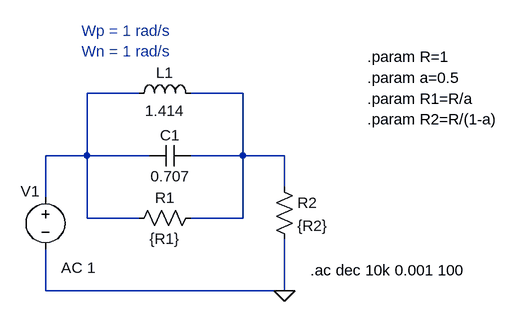
[diagram p0: schematic EJE2_B.asc]
EJE2_B.asc, the LTspice schematic file:
Version 4
SHEET 1 880 680
WIRE 80 64 0 64
WIRE 240 64 160 64
WIRE 0 160 0 64
WIRE 0 160 -64 160
WIRE 96 160 0 160
WIRE 240 160 240 64
WIRE 240 160 160 160
WIRE 304 160 240 160
WIRE 304 208 304 160
WIRE -64 224 -64 160
WIRE 0 256 0 160
WIRE 80 256 0 256
WIRE 240 256 240 160
WIRE 240 256 160 256
WIRE -64 368 -64 304
WIRE 304 368 304 288
WIRE 304 368 -64 368
FLAG 304 368 0
SYMBOL ind 64 80 R270
WINDOW 0 32 56 VTop 2
WINDOW 3 5 56 VBottom 2
SYMATTR InstName L1
SYMATTR Value 1.414
SYMBOL cap 160 144 R90
WINDOW 0 0 32 VBottom 2
WINDOW 3 32 32 VTop 2
SYMATTR InstName C1
SYMATTR Value 0.707
SYMBOL res 288 192 R0
SYMATTR InstName R2
SYMATTR Value {R2}
SYMBOL voltage -64 208 R0
WINDOW 123 24 124 Left 2
WINDOW 39 0 0 Left 0
WINDOW 0 -38 7 Left 2
SYMATTR Value2 AC 1
SYMATTR InstName V1
SYMATTR Value ""
SYMBOL res 176 240 R90
WINDOW 0 0 56 VBottom 2
WINDOW 3 32 56 VTop 2
SYMATTR InstName R1
SYMATTR Value {R1}
TEXT 432 40 Left 2 !.param a=0.5
TEXT 432 72 Left 2 !.param R1=R/a
TEXT 432 104 Left 2 !.param R2=R/(1-a)
TEXT 432 8 Left 2 !.param R=1
TEXT 344 336 Left 2 !.ac dec 10k 0.001 100
TEXT -8 -32 Left 2 ;Wp = 1 rad/s\nWn = 1 rad/s

The netlist it stands for:
* EJE2_B.asc
L1 N001 N002 1.414
C1 N002 N001 0.707
R2 N002 0 {R2}
V1 N001 0 AC 1
R1 N002 N001 {R1}
.param a=0.5
.param R1=R/a
.param R2=R/(1-a)
.param R=1
.ac dec 10k 0.001 100
* Wp = 1 rad/s
* Wn = 1 rad/s
.backanno
.end